# Altium schematic sheet DIY_ST-Link_V21.SchDoc
size A4; SheetNumber: 1; SheetTotal: 1
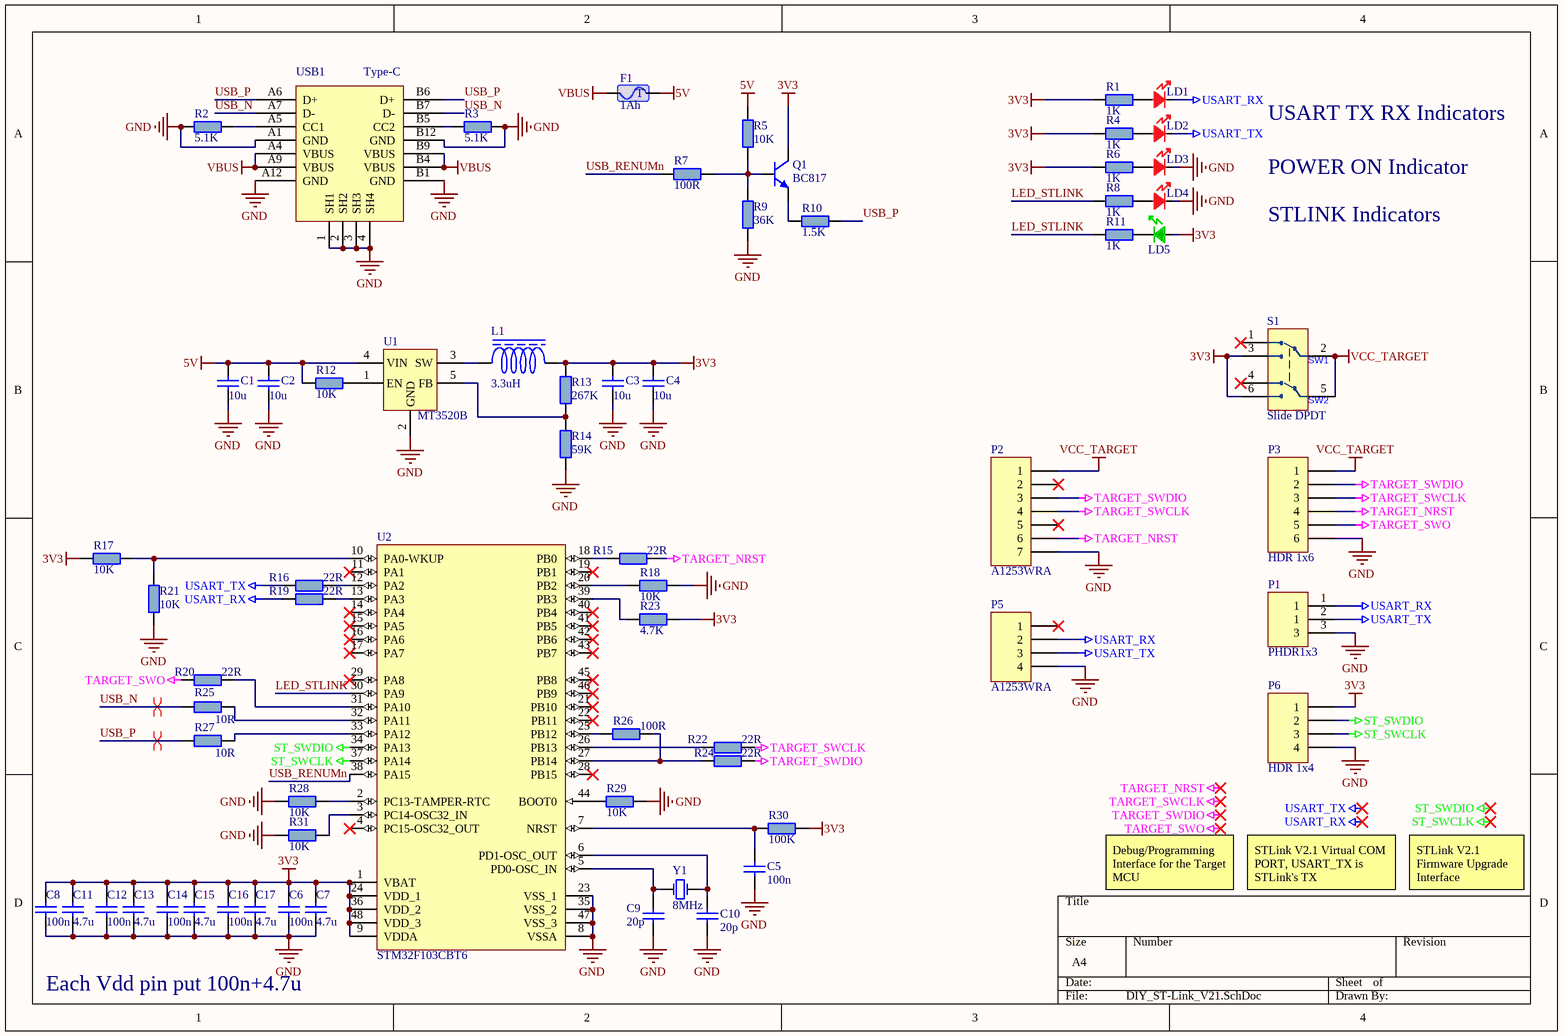
[diagram p0: DIY_ST-Link_V21.SchDoc]

## Parts
C1  10u  [0805_CAP]
C2  10u  [0805_CAP]
C3  10u  [0805_CAP]
C4  10u  [0805_CAP]
C5  100n  [0805_CAP]
C6  100n  [0805_CAP]
C7  4.7u  [0805_CAP]
C8  100n  [0805_CAP]
C9  20p  [0805_CAP]
C10  20p  [0805_CAP]
C11  4.7u  [0805_CAP]
C12  100n  [0805_CAP]
C13  4.7u  [0805_CAP]
C14  100n  [0805_CAP]
C15  4.7u  [0805_CAP]
C16  100n  [0805_CAP]
C17  4.7u  [0805_CAP]
F1  1Ah  [1206_PS]
L1  3.3uH  [IND_40x45x3.2]
LD1  Red  [LED0805_Red]  (value not drawn)
LD2  Red  [LED0805_Red]  (value not drawn)
LD3  Red  [LED0805_Red]  (value not drawn)
LD4  Red  [LED0805_Red]  (value not drawn)
LD5  Green  [LED0805_green]  (value not drawn)
P1  PHDR1x3  [HEADER_1x3]
P2  A1253WRA  [A1253WRA-7P]
P3  HDR 1x6  [HEADER_1x6]
P5  A1253WRA  [A1253WRA-4P]
P6  HDR 1x4  [HEADER_1x4]
Q1  BC817  [SOT23]
R1  1K  [0805_res]
R2  5.1K  [0805_res]
R3  5.1K  [0805_res]
R4  1K  [0805_res]
R5  10K  [0805_res]
R6  1K  [0805_res]
R7  100R  [0805_res]
R8  1K  [0805_res]
R9  36K  [0805_res]
R10  1.5K  [0805_res]
R11  1K  [0805_res]
R12  10K  [0805_res]
R13  267K  [0805_res]
R14  59K  [0805_res]
R15  22R  [0805_res]
R16  22R  [0805_res]
R17  10K  [0805_res]
R18  10K  [0805_res]
R19  22R  [0805_res]
R20  22R  [0805_res]
R21  10K  [0805_res]
R22  22R  [0805_res]
R23  4.7K  [0805_res]
R24  22R  [0805_res]
R25  10R  [0805_res]
R26  100R  [0805_res]
R27  10R  [0805_res]
R28  10K  [0805_res]
R29  10K  [0805_res]
R30  100K  [0805_res]
R31  10K  [0805_res]
S1  Slide DPDT  [SW_DPDT_SMD]
U1  MT3520B  [SOT23-5]
U2  STM32F103CBT6  [LQFP-48]
USB1  Type-C  [Type-C-TOP]
Y1  8MHz  [Xtal_HC49_US]

## Nets
3V3: C3.2 C4.2 C6.2 C7.2 C8.2 C11.2 C12.2 C13.2 C14.2 C15.2 C16.2 C17.2 L1.2 LD5.1(A) P6.1 Q1.3(C) R1.2 R4.2 R6.2 R13.1 R17.2 R23.1 R30.1 S1.3(NO1) S1.6(NO2) U2.1(VBAT) U2.9(VDDA) U2.24(VDD_1) U2.36(VDD_2) U2.48(VDD_3)
5V: C1.2 C2.2 F1.2 R5.2 R12.2 U1.4(VIN)
GND: C1.1 C2.1 C3.1 C4.1 C5.1 C6.1 C7.1 C8.1 C9.1 C10.1 C11.1 C12.1 C13.1 C14.1 C15.1 C16.1 C17.1 LD3.2(K) LD4.2(K) P1.3 P2.7 P3.6 P5.4 P6.4 R2.1 R3.1 R9.1 R14.2 R18.1 R21.1 R28.2 R29.1 R31.2 U1.2(GND) U2.8(VSSA) U2.23(VSS_1) U2.35(VSS_2) U2.47(VSS_3) USB1.1(SH1) USB1.2(SH2) USB1.3(SH3) USB1.4(SH4) USB1.A1(GND) USB1.A12(GND) USB1.B1(GND) USB1.B12(GND)
ST_SWCLK: P6.3 U2.37(PA14)
ST_SWDIO: P6.2 U2.34(PA13)
TARGET_NRST: P2.6 P3.4 R15.1
TARGET_SWCLK: P2.4 P3.3 R22.1
TARGET_SWDIO: P2.3 P3.2 R24.1
TARGET_SWO: P3.5 R20.2
USART_RX: LD1.2(K) P1.1 P5.2 R19.2
USART_TX: LD2.2(K) P1.2(1) P5.3 R16.2
VBUS: F1.1 USB1.A4(VBUS) USB1.A9(VBUS) USB1.B4(VBUS) USB1.B9(VBUS)
VCC_TARGET: P2.1 P3.1 S1.2(C1) S1.5(C2)
LED_STLINK: R8.2 R11.2 U2.30(PA9)
USB_N: R25.2 USB1.A7(D-) USB1.B7(D-)
USB_P: R10.2 R27.2 USB1.A6(D+) USB1.B6(D+)
USB_RENUMn: R7.1 U2.38(PA15)
NetC5_2: C5.2 R30.2 U2.7(NRST)
NetC9_2: C9.2 U2.5(PD0-OSC_IN) Y1.1(OSC1)
NetC10_2: C10.2 U2.6(PD1-OSC_OUT) Y1.2(OSC2)
NetL1_1: L1.1 U1.3(SW)
NetLD1_1: LD1.1(A) R1.1
NetLD2_1: LD2.1(A) R4.1
NetLD3_1: LD3.1(A) R6.1
NetLD4_1: LD4.1(A) R8.1
NetLD5_2: LD5.2(K) R11.1
NetQ1_1: Q1.1(B) R5.1 R7.2 R9.2
NetQ1_2: Q1.2(E) R10.1
NetR2_2: R2.2 USB1.A5(CC1)
NetR3_2: R3.2 USB1.B5(CC2)
NetR12_1: R12.1 U1.1(EN)
NetR13_2: R13.2 R14.1 U1.5(FB)
NetR15_2: R15.2 U2.18(PB0)
NetR16_1: R16.1 U2.12(PA2)
NetR17_1: R17.1 R21.2 U2.10(PA0-WKUP)
NetR18_2: R18.2 U2.20(PB2)
NetR19_1: R19.1 U2.13(PA3)
NetR20_1: R20.1 U2.31(PA10)
NetR22_2: R22.2 U2.26(PB13)
NetR23_2: R23.2 U2.39(PB3)
NetR24_2: R24.2 R26.1 U2.27(PB14)
NetR25_1: R25.1 U2.32(PA11)
NetR26_2: R26.2 U2.25(PB12)
NetR27_1: R27.1 U2.33(PA12)
NetR28_1: R28.1 U2.2(PC13-TAMPER-RTC)
NetR29_2: R29.2 U2.44(BOOT0)
NetR31_1: R31.1 U2.3(PC14-OSC32_IN)

Not connected (* = marked no-connect by the designer): P2 2* 5*; P5 1*; S1 1(NC1)* 4(NC2)*; U2 4(PC15-OSC32_OUT)* 11(PA1)* 14(PA4)* 15(PA5)* 16(PA6)* 17(PA7)* 19(PB1)* 21(PB10)* 22(PB11)* 28(PB15)* 29(PA8)* 40(PB4)* 41(PB5)* 42(PB6)* 43(PB7)* 45(PB8)* 46(PB9)*

## Layout directives
differential pair: USB_N, USB_P

## Notes on the sheet
- USART TX RX Indicators
- POWER ON Indicator
- STLINK Indicators
- Debug/Programming Interface for the Target MCU
- STLink V2.1 Virtual COM PORT, USART_TX is STLink's TX
- STLink V2.1 Firmware Upgrade Interface
- Each Vdd pin put 100n+4.7u
- Labels drawn without touching a wire or pin: ST_SWCLK, ST_SWDIO, TARGET_NRST, TARGET_SWCLK, TARGET_SWDIO, TARGET_SWO, USART_RX, USART_TX
- (in symbol Fuse_PS_1A6V_3216) T
- (in symbol SW_Slide_DPDT) SW1; SW2

## Library data of the parts
C1-C17 = CC_?F_0805: Capacitor, Ceramic,, ?F, ?V, 0805
F1 = Fuse_PS_1A6V_3216: Fuse, Polyswitch, 1Ah 1.8At, 6V, 8A @300msec, 210mRmax, 1206 [3216]; Category: Fuse; Supplier 2: Farnell; Supplier Part Number 2: 1861192; URL: http://www.farnell.com/datasheets/1678471.pdf
L1 = IND_?uH_4045: https://www.lcsc.com/product-detail/Inductors-SMD_SHOU-HAN-CY43-3-3UH_C2929417.html
LD1-LD4 = LED_RED230mcd_2013: LED, Red, 2.0V, Imax 30mA, 120deg. At 20mA => Wavelength = 630nm, 230mcd, 0805; Manufacturer: Kingbright; Mfg_PN: KPT-2012SURCK; Used_for: Alarm; Category: Diode - LED; URL: http://www.farnell.com/datasheets/1753997.pdf; Supplier 2: Farnell; Supplier Part Number 2: 2099241
LD5 = LED_GRN50mcd_2013: LED, Green, 2.1V, Imax 30mA, 110deg. At 20mA => Wavelength = 570nm, 50mcd, 0805; Manufacturer: Kingbright; Mfg_PN: KPHCM-2012CGCK; Used_for: ACC ON; Category: Diode - LED; Supplier 2: Element14; Supplier Part Number 2: 1686075; Supplier 3: Digikey; Supplier Part Number 3: 754-1127-1-ND
P1 = Header1x3: Header, 3 pin SIL, 2.54 pitch; Notes: TE295 is actually a 40 pin break away header; Category: Connector; Supplier 1: Brooks; Supplier Part Number 1: TE295
P2 = A1253WRA-7P: A1253WRA-4P; Notes: TE295 is actually a 40 pin break away header; Engineer’s Name: WZ; Category: Connector; Supplier 1: Brooks; Supplier Part Number 1: TE295; Date Updated: 1/7/2014
P3 = Header1x6: Header_1x6; Notes: TE295 is actually a 40 pin break away header; Category: Connector; Supplier 1: Brooks; Supplier Part Number 1: TE295
P5 = A1253WRA-4P: Notes: TE295 is actually a 40 pin break away header; Engineer’s Name: WZ; Category: Connector; Supplier 1: Brooks; Supplier Part Number 1: TE295; Date Updated: 1/7/2014
P6 = Header1x4: Header_1x4; Notes: TE295 is actually a 40 pin break away header; Engineer’s Name: WZ; Category: Connector; Supplier 1: Brooks; Supplier Part Number 1: TE295; Date Updated: 1/7/2014
Q1 = TR_BC817: TRANSISTOR, NPN, SOT-23, 45V; Manufacturer: NXP; PackageReference: SOT23; PackageDescription: 3-Pin SOT-23 Package 0.95 mm Pitch, 2.3 mm Lead Span; Mfg_PN: BC817; Supplier 1: *; Supplier 2: Element 14; Supplier Part Number 1: *; Supplier Part Number 2: 1081223; Value: BC817; Note: TRANSISTOR, NPN, SOT-23, 45V; Category: Transistor; Supplier 3: Digikey; Supplier Part Number 3: 1727-2919-1-ND
R1-R31 = RS_?R_0805: Resistor, ?ohm, 0805
S1 = SW_Slide_DPDT: LCSC#: C2906280 / Mfr.#: MST22D18G2 125 / Mfr: SHOU HAN / Brick nogging 0.1A DPDT 12V Black 10000次 SMD Slide Switches ROHS
U1 = BUCK_MT3520B: https://www.lcsc.com/product-detail/DC-DC-Converters_XI-AN-Aerosemi-Tech-MT3520B_C2684933.html
U2 = STM32F103CBT6: ARM Cortex-M3 32-bit MCU, 128 KB Flash, 20 KB Internal RAM, 37 I/Os, 48-pin LQFP, -40 to 85 degC, Tray; A/D Converter: 2x12-bit (10 Channel); FLASH Size (Prog) (kB): 128; I/Os (High Current): 37; Internal RAM Size (kB): 20; Operating Frequency(F) (Processor speed) (MHz): 72; Supply Voltage(Vcc) min (V): 2; DatasheetVersion: Rev. 16; PackageVersion: Rev. 6, 06/2013; PackageReference: LQFP48; PackageDescription: 48-Pin Low Profile Quad Flat Package, 7 x 7 mm Body, 0.5 mm Pitch; Supplier 1: Digi-Key; Supplier Part Number 1: 497-6288-ND; Supplier 2: Farnell; Supplier Part Number 2: 1606327; Core: ARM Cortex-M3; Packing: Tray; Mounting Technology: Surface Mount; PartNumber: STM32F103CBT6; ComponentLink1Description: Manufacturer URL; ComponentLink1URL: http://www.st.com/web/en/home.html; ComponentLink2Description: Datasheet; ComponentLink2URL: http://www.st.com/st-web-ui/static/active/en/resource/technical/document/datasheet/CD00161566.pdf; ComponentLink3Description: Package Specification; ComponentLink3URL: http://www.st.com/st-web-ui/static/active/en/resource/technical/document/datasheet/DM00058181.pdf; Supplier 3: Newark; Supplier Part Number 3: 11N8296; Supplier 4: Newark; Supplier Part Number 4: 57P1214; Supplier 5: Mouser; Supplier Part Number 5: 511-STM32F103CBT6
USB1 = USB-Type-C-TOP: https://www.lcsc.com/product-detail/span-style-background-color-ff0-USB-span-Connectors_DEALON-USB-TYPE-C-018_C2927038.html
Y1 = XTAL-SMD_HC49: Crystal, SMD, HC49 Size; Manufacturer: Abracon Corporation; Note: Crystal Oscillator, 32MHZ, 18PF, SMD, 30ppm, 50ohm, Fundamental; Value: XTAL = 32MHz; Mfg_PN: ABM2-32.000MHZ-D4YF-T; Supplier 2: Digi-Key; Supplier Part Number 2: 535-10894-2-ND; Supplier Part Number 1: *; Supplier 1: *